# EAGLE design mega328 (EAGLE 9.5.0)
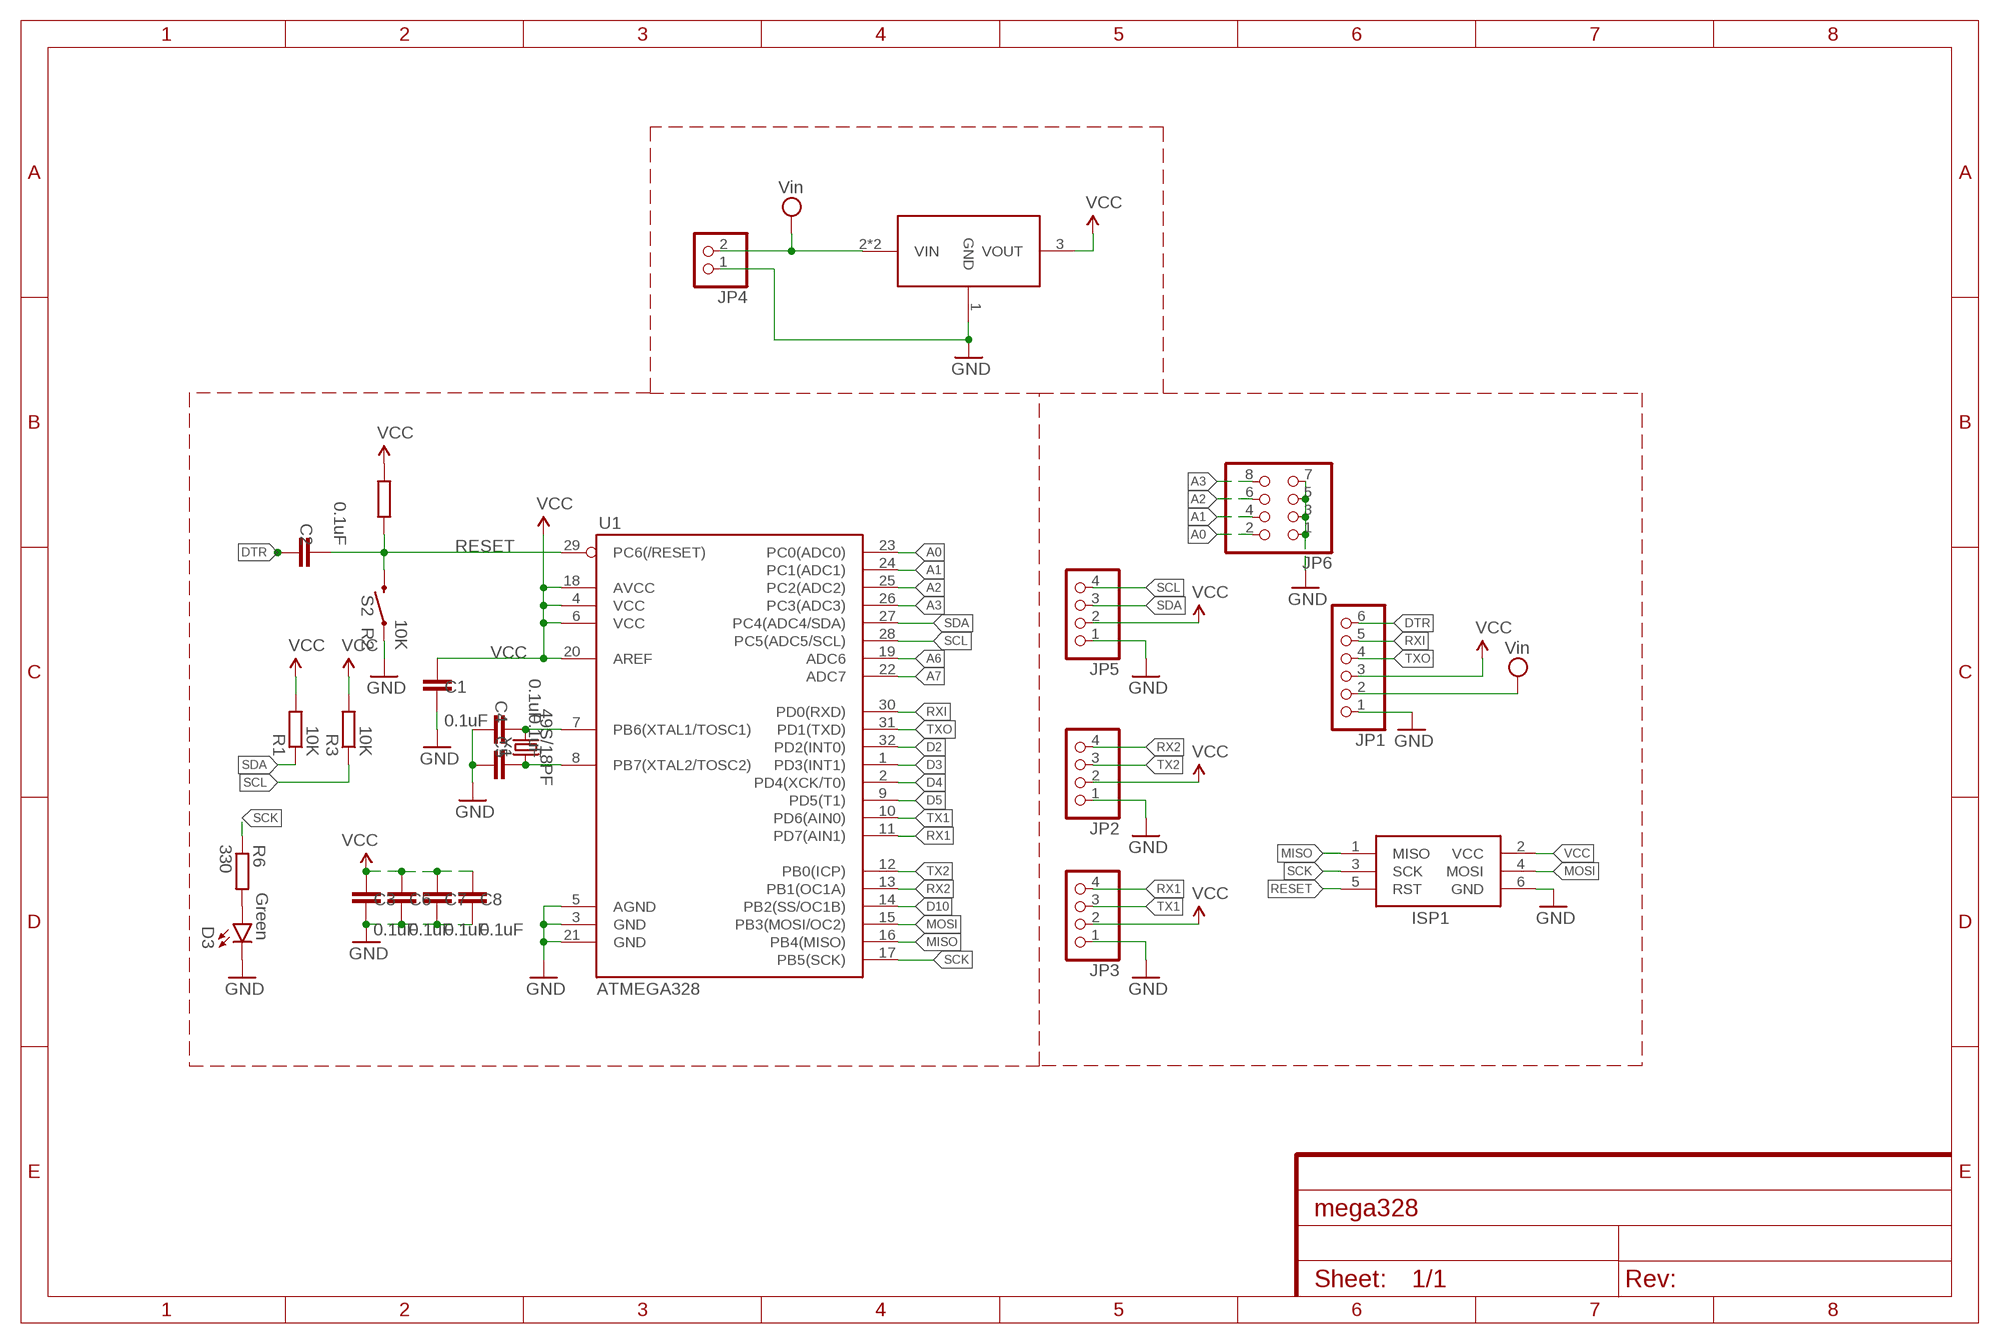
[diagram p0: schematic, sheet 1]

## Parts
C1  0.1uF  C-EUC0805  [C0805]
C2  0.1uF  C-EUC0805  [C0805]
C3  0.1uF  C-EUC0805  [C0805]
C4  0.1uF  C-EUC0805  [C0805]
C5  0.1uF  C-EUC0805  [C0805]
C6  0.1uF  C-EUC0805  [C0805]
C7  0.1uF  C-EUC0805  [C0805]
C8  0.1uF  C-EUC0805  [C0805]
D3  Green  LEDCHIP-LED0805  [CHIP-LED0805]
ISP1  AVRISP3D  [2X03]
JP1  PINHD-1X06_2.54-S  [1X06]
JP2  PINHD-1X04_2.54-S  [1X04-S]
JP3  PINHD-1X04_2.54-S  [1X04-S]
JP4  PINHD-1X02_2.54-S  [1X02-S]
JP5  PINHD-1X04_2.54-S  [1X04-S]
JP6  PINHD-2X4  [2X04]
R1  10K  R-EU_R0805  [R0805]
R2  10K  R-EU_R0805  [R0805]
R3  10K  R-EU_R0805  [R0805]
R6  330  R-EU_R0805  [R0805]
S2  MOMENTARY-SWITCH-SPST-PTH-6.0MM  [TACTILE_SWITCH_PTH_6.0MM]
U1  ATMEGA328  ATMEGA168  [TQFP32-08]
U$1  AIC1722A-33PXATR  [SOT89]
Y1  49S/18PF  [XTAL_HC49]

## Nets
A0: JP6.2 U1.23(PC0(ADC0))
A1: JP6.4 U1.24(PC1(ADC1))
A2: JP6.6 U1.25(PC2(ADC2))
A3: JP6.8 U1.26(PC3(ADC3))
A6: U1.19(ADC6)
A7: U1.22(ADC7)
D2: U1.32(PD2(INT0))
D3: U1.1(PD3(INT1))
D4: U1.2(PD4(XCK/T0))
D5: U1.9(PD5(T1))
D10: U1.14(PB2(SS/OC1B))
DTR: C2.2 JP1.6
GND: C1.1 C3.1 C4.2 C5.2 C6.1 C7.1 C8.1 D3.C ISP1.6(GND) JP1.1 JP2.1 JP3.1 JP4.1 JP5.1 JP6.1 JP6.3 JP6.5 JP6.7 S2.1 S2.2 U1.3(GND) U1.5(AGND) U1.21(GND) U$1.1(GND)
MISO: ISP1.1(MISO) U1.16(PB4(MISO))
MOSI: ISP1.4(MOSI) U1.15(PB3(MOSI/OC2))
N$1: C5.1 U1.8(PB7(XTAL2/TOSC2)) Y1.1
N$2: C4.1 U1.7(PB6(XTAL1/TOSC1)) Y1.2
N$7: D3.A R6.2
RESET: C2.1 ISP1.5(RST) R2.1 S2.3 S2.4 U1.29(PC6(/RESET))
RX1: JP3.4 U1.11(PD7(AIN1))
RX2: JP2.4 U1.13(PB1(OC1A))
RXI: JP1.5 U1.30(PD0(RXD))
SCK: ISP1.3(SCK) R6.1 U1.17(PB5(SCK))
SCL: JP5.4 R3.1 U1.28(PC5(ADC5/SCL))
SDA: JP5.3 R1.1 U1.27(PC4(ADC4/SDA))
TX1: JP3.3 U1.10(PD6(AIN0))
TX2: JP2.3 U1.12(PB0(ICP))
TXO: JP1.4 U1.31(PD1(TXD))
VCC: C1.2 C3.2 C6.2 C7.2 C8.2 ISP1.2(VCC) JP1.3 JP2.2 JP3.2 JP5.2 R1.2 R2.2 R3.2 U1.4(VCC) U1.6(VCC) U1.18(AVCC) U1.20(AREF) U$1.3(VOUT)
VIN: JP1.2 JP4.2 U$1.2(VIN) U$1.2@1(VIN) ; supply symbol labelled Vin

## Library data of the parts
C1-C8 = rcl:C-EU: CAPACITOR, European symbol; SPICEPREFIX: C
D3 = led:LED: LED OSRAM: - CHIPLED LG R971, LG N971, LY N971, LG Q971, LY Q971, LO R971, LY R971 LH N974, LH R974 LS Q976, LO Q976, LY Q976 LO Q996 - Hyper CHIPLED LW Q18S LB Q993, LB Q99A, LB R99A - SideLED LS A670, LO A670, LY A670, LG A670, LP A670 LB A673, LV A673, LT A673, LW A673 LH A674 LY A675 LS A676, LA A676, LO A676, LY A676, LW A676 LS A679, LY A679, LG A679 - Hyper Micro SIDELED® LS Y876, LA Y876, LO Y876, LY Y876 LT Y87S - SmartLED LW L88C, LW L88S LB L89C, LB L89S, LG L890 LS L89K, LO L89K, LY L89K LS L896, LA L896, LO L896, LY L896 - TOPLED LS T670, LO T670, LY T670, LG T670, LP T670 LSG T670, LSP T670, LSY T670, LOP T670, LYG T670 LG T671, LOG T671, LSG T671 LB T673, LV T673, LT T673, LW T673 LH T674 LS T676, LA T676, LO T676, LY T676, LB T676, LH T676, LSB T676, LW T676 LB T67C, LV T67C, LT T67C, LS T67K, LO T67K, LY T67K, LW E67C LS E67B, LA E67B, LO E67B, LY E67B, LB E67C, LV E67C, LT E67C LW T67C LS T679, LY T679, LG T679 LS T770, LO T770, LY T770, LG T770, LP T770 LB T773, LV T773, LT T773, LW T773 LH T774 LS E675, LA E675, LY E675, LS T675 LS T776, LA T776, LO T776, LY T776, LB T776 LHGB T686 LT T68C, LB T68C - Hyper Mini TOPLED® LB M676 - Mini TOPLED Santana® LG M470 LS M47K, LO M47K, LY M47K Source: http://www.osram.convergy.de LUXEON: - LUMILED® LXK2-PW12-R00, LXK2-PW12-S00, LXK2-PW14-U00, LXK2-PW14-V00 LXK2-PM12-R00, LXK2-PM12-S00, LXK2-PM14-U00 LXK2-PE12-Q00, LXK2-PE12-R00, LXK2-PE12-S00, LXK2-PE14-T00, LXK2-PE14-U00 LXK2-PB12-K00, LXK2-PB12-L00, LXK2-PB12-M00, LXK2-PB14-N00, LXK2-PB14-P00, LXK2-PB14-Q00 LXK2-PR12-L00, LXK2-PR12-M00, LXK2-PR14-Q00, LXK2-PR14-R00 LXK2-PD12-Q00, LXK2-PD12-R00, LXK2-PD12-S00 LXK2-PH12-R00, LXK2-PH12-S00 LXK2-PL12-P00, LXK2-PL12-Q00, LXK2-PL12-R00 Source: www.luxeon.com KINGBRIGHT: KA-3528ASYC Source: www.kingbright.com
ISP1 = adafruit-edit:AVRISP: AVR ISP HEADER Standard 6 pin header for AVR programming
JP1 = pinhead-2:PINHD-1X06: PIN HEADER
JP2 JP3 JP5 = pinhead-2:PINHD-1X04: PIN HEADER
JP4 = pinhead-2:PINHD-1X02: PIN HEADER
JP6 = pinhead:PINHD-2X4: PIN HEADER
R1-R3 R6 = rcl:R-EU_: RESISTOR, European symbol; SPICEPREFIX: R
S2 = SparkFun-Switches-edit:MOMENTARY-SWITCH-SPST: Momentary Switch (Pushbutton) - SPST Normally-open (NO) SPST momentary switches (buttons, pushbuttons). Variants PTH-12MM - 12mm square, through-hole Momentary Pushbutton Switch - 12mm Square <https://www.sparkfun.com/products/9190> (COM-09190) PTH-6.0MM, PTH-6.0MM-KIT - 6.0mm square, through-hole Mini Pushbutton Switch <https://www.sparkfun.com/products/97> (COM-00097) KIT package intended for soldering kit's - only one side of pads' copper is exposed. PTH-RIGHT-ANGLE-KIT - Right-angle, through-hole Right Angle Tactile Button <https://www.sparkfun.com/products/10791> - Used on SparkFun BigTime Watch Kit <https://www.sparkfun.com/products/11734> SMD-12MM - 12mm square, surface-mount Tactile Button - SMD (12mm) <https://www.sparkfun.com/products/12993> (COM-12993) Used on SparkFun PicoBoard <https://www.sparkfun.com/products/11888> SMD-4.5MM - 4.5mm Square Trackball Switch Used on SparkFun Blackberry Trackballer Breakout <https://www.sparkfun.com/products/13169> SMD-4.6MMX2.8MM - 4.60mm x 2.80mm, surface mount Used on SparkFun SAMD21 Mini Breakout <https://www.sparkfun.com/products/13664> SMD-5.2MM, SMD-5.2-REDUNDANT - 5.2mm square, surface-mount Mini Pushbutton Switch - SMD <https://www.sparkfun.com/products/8720> (COM-08720) Used on Arduino Pro Mini <https://www.sparkfun.com/products/11114> REDUNDANT package connects both switch circuits together SMD-6.0X3.5MM - 6.0 x 3.5mm, surface mount Momentary Reset Switch SMD <https://www.sparkfun.com/products/8229> (COM-08229) SMD-6.2MM-TALL - 6.2mm square, surface mount Tactile Button - SMD (6mm) <https://www.sparkfun.com/products/12992> Used on SparkFun Digital Sandbox <https://www.sparkfun.com/products/12651> SMD-RIGHT-ANGLE - Right-angle, surface mount Used on SparkFun Block for Intel® Edison - Arduino <https://www.sparkfun.com/products/13036>; PROD_ID: SWCH-08441; SF_SKU: COM-00097
U1 = mega328:ATMEGA168
U$1 = AIC1722-33PXATR:AIC1722A-33PXATR
Y1 = Crystals:49S/18PF: Crystal Manufacturer's datasheet <https://datasheet.octopart.com/49S-18PF-Xinhunjing-datasheet-30677139.pdf>; CREATED_BY: PCBLayout.com; MANUFACTURER: Xinhunjing; MPN: 49S/18PF; PACKAGE: SMD

## Net classes
0 default: width 0.203 mm
1 vcc: width 0.254 mm

## Board
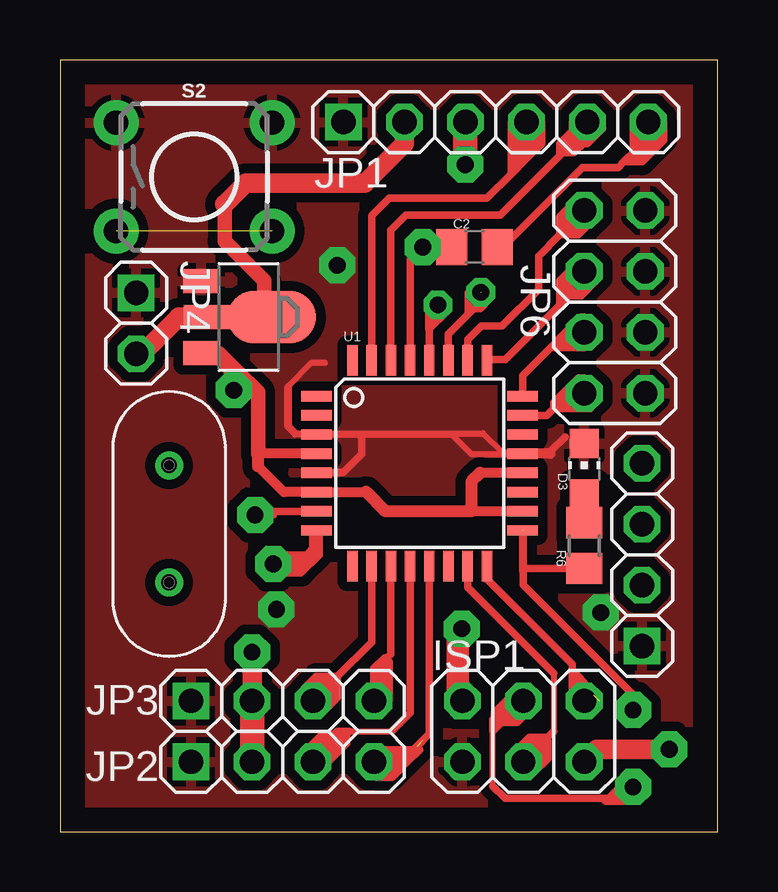
[diagram p1: board, top side]
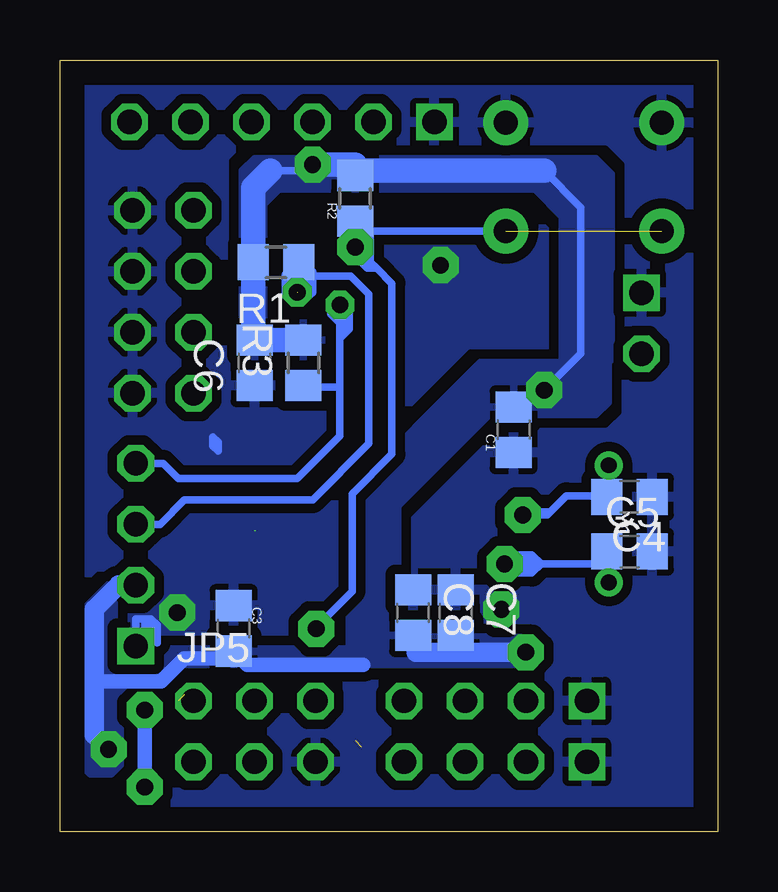
[diagram p2: board, bottom side, seen from below]

Size 27.41 x 32.18 mm. Coordinates in mm from the lower left corner, seen from the top.
Outline: 0,0 27.41,0 27.41,32.18 0,32.18 0,0
Copper layers (1*16): Top 0.035mm / dielectric 1.5mm / Bottom 0.035mm
Design rules "local_pcb": minimum track width 10mil, minimum drill 0.7mm, track to track 16mil, track to pad 16mil, pad to pad 16mil, via to via 16mil, smd to smd 2mil, copper to edge 40mil, drill to drill 6mil, minimum pad ring 10mil, minimum via ring 8mil, stop-mask expansion 4mil, vias tented up to drill 0mil, thermal gap 10mil

### Footprints (pad centres in the part's own frame; a part is rotated, then mirrored left to right if it is on the bottom)
C0805 = smd 1.3 x 1.5: 1 -0.95,0; 2 0.95,0
CHIP-LED0805 = smd 1.2 x 1.2: A 0,-1.05; C 0,1.05
2X03 = drill 1.016 octagon: 1 -2.54,-1.27; 2 -2.54,1.27; 3 0,-1.27; 4 0,1.27; 5 2.54,-1.27; 6 2.54,1.27
1X06 = drill 1.016 square: 1 -6.35,0 | drill 1.016 octagon: 2 -3.81,0; 3 -1.27,0; 4 1.27,0; 5 3.81,0; 6 6.35,0
1X04-S = drill 1.016 square: 1 -3.81,0 | drill 1.016 octagon: 2 -1.27,0; 3 1.27,0; 4 3.81,0
1X02-S = drill 1.016 square: 1 -1.27,0 | drill 1.016 octagon: 2 1.27,0
2X04 = drill 1.016 octagon: 1 -3.81,-1.27; 2 -3.81,1.27; 3 -1.27,-1.27; 4 -1.27,1.27; 5 1.27,-1.27; 6 1.27,1.27; 7 3.81,-1.27; 8 3.81,1.27
R0805 = smd 1.3 x 1.5: 1 -0.95,0; 2 0.95,0
TACTILE_SWITCH_PTH_6.0MM = drill 1.016 pad 1.88: 1 -3.251,2.261; 2 3.251,2.261; 3 -3.251,-2.261; 4 3.251,-2.261
TQFP32-08 = smd 1.27 x 0.432: 1 -4.293,2.8; 2 -4.293,2; 3 -4.293,1.2; 4 -4.293,0.4; 5 -4.293,-0.4; 6 -4.293,-1.2; 7 -4.293,-2; 8 -4.293,-2.8; 17 4.293,-2.8; 18 4.293,-2; 19 4.293,-1.2; 20 4.293,-0.4; 21 4.293,0.4; 22 4.293,1.2; 23 4.293,2; 24 4.293,2.8 | smd 0.432 x 1.27: 9 -2.8,-4.293; 10 -2,-4.293; 11 -1.2,-4.293; 12 -0.4,-4.293; 13 0.4,-4.293; 14 1.2,-4.293; 15 2,-4.293; 16 2.8,-4.293; 25 2.8,4.293; 26 2,4.293; 27 1.2,4.293; 28 0.4,4.293; 29 -0.4,4.293; 30 -1.2,4.293; 31 -2,4.293; 32 -2.8,4.293
SOT89 = smd 1 x 1.5: 1 -1.499,-1.981; 3 1.499,-1.981 | smd 1 x 2: 2 0,-1.727 | smd 2.2 x 3.7: 2@1 0,0.94
XTAL_HC49 = drill 0.65 pad 1.05: 1 -2.44,0; 2 2.44,0

### Placement (x,y rotation side)
C1  8.51,16.76 90 bottom
C2  17.27,24.38 0 top
C3  20.18,8.48 270 bottom
C4  3.68,13.97 0 bottom
C5  3.68,11.68 0 bottom
C6  19.3,19.56 90 bottom
C7  10.92,9.14 270 bottom
C8  12.7,9.14 270 bottom
D3  21.84,15.14 0 top
ISP1  19.3,4.19 180 top
JP1  18.16,29.59 0 top
JP2  9.27,2.92 0 top
JP3  9.27,5.46 0 top
JP4  3.17,21.21 270 top
JP5  24.26,11.56 90 top
JP6  23.11,22.1 90 top
R1  18.41,23.75 180 bottom
R2  15.11,26.42 90 bottom
R3  17.27,19.56 90 bottom
R6  21.84,11.94 90 top
S2  5.59,27.3 0 top
U1  14.99,15.37 0 top
U$1  7.87,21.46 270 top
Y1  4.55,12.84 90 top

### Tracks (layer width: path | path; a pad name or v marks a point on that pad's centre or on a via)
A0
  Top 0.305: U1.23 20.29,17.37 20.57,17.65 | 20.57,17.65 21.21,18.29 JP6.2 21.84,18.92 21.59,18.92 20.57,17.91 20.57,17.65 | 20.57,17.65 22.1,17.65 21.97,17.78 21.97,17.91 21.08,17.91 20.95,17.78
A1
  Top 0.305: U1.24 19.28,19.02 20.45,20.19 | 20.45,20.19 21.08,20.83 | 21.08,20.83 JP6.4 21.84,21.46 21.72,21.46 21.08,20.83 | 20.45,20.19 21.84,20.19 21.84,20.45 20.83,20.45 21.46,21.08 21.72,21.08
A2
  Top 0.305: U1.25 17.79,19.68 18.54,19.68 19.18,20.32 20.83,21.97 | JP6.6 21.84,22.99 21.21,22.35 | 21.21,22.35 20.83,21.97 | JP6.6 21.21,23.37 21.21,22.35 | 21.21,22.35 21.72,22.35 22.35,22.99 21.97,23.37 JP6.6 | JP6.6 21.72,23.24 21.34,23.24 21.34,22.73 | 21.34,22.73 21.34,22.61 21.46,22.48 22.1,23.11 21.72,23.11 21.34,22.73 | 20.83,21.97 20.83,22.99 20.95,23.11 | 21.46,23.62 20.95,23.11 | 20.95,23.11 20.95,22.35
A3
  Top 0.305: U1.26 16.99,20.52 17.55,21.08 18.41,21.08 19.94,22.61 19.94,24 20.83,24.89 | 20.83,24.89 JP6.8 21.46,26.29 20.83,25.65 20.83,24.89 | 20.83,24.89 21.59,24.89 22.23,25.53 21.97,25.78 21.21,25.02 21.59,25.02 22.1,25.53 21.72,25.91 21.46,25.91 20.95,25.4 20.95,25.27
DTR
  Top 0.305: 23.5,27.94 23.25,27.7 21.77,27.7 18.45,24.38 C2.2 | 23.5,27.94 23.62,28.07 | 23.88,28.32 24.51,28.96 JP1.6 25.15,29.59 25.15,29.21 | 25.15,29.21 24,28.07 23.62,28.07 | 23.62,28.07 23.88,28.32 | 23.88,28.32 23.88,29.59 24.26,29.59 24.26,29.08 24,28.83 | 25.15,29.21 25.15,28.83 24.26,27.94 23.5,27.94
GND  (via drill 0.7 pad 1.5)
  Top 0.254: 19.68,15.77 19.67,15.75 17.18,15.75 17.17,15.75 17.14,15.75 16.33,16.57 12.45,16.57 U1.3 9.8,16.57 9.47,16.89 9.47,18.55 9.53,18.6 | 20.14,15.82 18.42,15.82 17.62,16.62 9.84,16.62 9.53,16.93 9.53,18.6 | 11.05,19.56 10.48,19.56 9.53,18.6
  Top 0.305: U1.5 10.71,14.99 11.81,14.99 12.57,15.75 12.57,16.44 12.45,16.57 | 21.04,16.47 20.45,15.88 20.45,15.77
  Top 0.406: U1.21 19.68,15.77 20.45,15.77
  Bottom 0.305: 23.37,7.87 23.37,8.64 23.62,8.89 24.26,8.89 JP5.1 23.88,8.13 23.88,8.76 23.62,8.51 23.62,7.87 | 21.04,16.47 20.83,16.26 20.83,15.88 21.04,16.09 21.04,16.47
  other vias: 11.56,23.62 9.02,9.27 22.53,9.14
  pour Top (isolate 0.305, rank 2): 0,32.18 0,0 27.29,0 27.29,32.18
  pour Bottom (isolate 0.305, rank 2): 0,32.18 0,0 27.29,0 27.29,32.18
MISO  (1 unrouted)
  Top 0.305: 21.59,6.48 21.84,6.22 ISP1.1 22.48,5.46 | 21.59,6.48 21.34,6.73 | U1.16 17.78,10.54 21.34,6.99 21.34,6.73 | 21.34,6.73 21.34,5.46 21.59,5.46 21.59,6.48 | 22.23,5.71 21.97,5.97
MOSI
  Top 0.254: 20.57,6.6 20.57,4.19
  Top 0.305: U1.15 16.99,10.19 20.57,6.6 | 20.57,4.19 20.32,3.94 | 20.32,3.94 ISP1.4 18.92,3.3 19.56,3.94 20.32,3.94 | 20.32,3.94 20.32,3.05 19.68,2.41 19.56,2.54 19.56,2.79 20.19,3.43 20.19,3.17 19.68,2.67 19.3,3.05 19.3,3.3 19.81,3.81
N$1  (via drill 0.7 pad 1.5)
  Top 0.305: U1.8 10.69,11.46 10.41,11.18 v8.89,11.18 | v8.89,11.18 8.89,11.3 | 8.89,11.3 8.89,11.56 10.29,11.56 10.54,11.81 | 10.54,11.81 10.54,12.57 | 10.54,11.81 10.54,11.68 10.16,11.3 8.89,11.3 | 8.89,11.05 8.89,10.79 10.03,10.79 10.79,11.56 10.79,12.57 | v8.89,11.18 8.89,11.05 | 8.89,11.05 10.03,11.05
  Bottom 0.305: 7.37,11.18 v8.89,11.18 8.89,11.56 7.75,11.56 7.37,11.18 | C5.1 4.55,11.6 4.55,11.3 | 4.55,11.3 Y1.1 | 7.37,11.18 7.75,10.79 8.89,10.79 8.89,10.92 7.87,10.92 7.87,11.43 8.76,11.43 | 4.55,11.3 4.67,11.18 7.37,11.18
N$2  (via drill 0.7 pad 1.5)
  Top 0.305: U1.7 8.29,13.37 v8.13,13.21 8.89,13.21
  Bottom 0.305: 6.99,13.34 7.11,13.21 v8.13,13.21 8.13,13.34 6.99,13.34 | 6.99,13.34 6.31,14.01 4.67,14.01 4.55,14.01 Y1.2
  Bottom 1.016: 4.67,14.01 C4.1
N$7
  Top 0.305: R6.2 D3.A
RESET  (via drill 0.7 pad 1.5)  (1 unrouted)
  Top 0.305: U1.29 14.59,23.86 v15.11,24.38 | 16.51,8.48 16.51,8.64 16.26,8.64 16.26,6.86 16.51,6.6 16.51,5.46 | 16.51,8.47 16.51,6.99 16.76,6.73 ISP1.5 16.26,5.46 16.26,6.99 | 16.89,6.73 16.89,8.47 v16.74,8.47 16.51,8.47 | 16.89,5.46 16.89,6.73 | 16.89,6.73 16.64,6.99 16.64,8.51 | 16.51,8.48 16.26,8.48 16.26,7.11 | 16.51,8.48 16.51,8.47
  Top 0.508: C2.1 v15.11,24.38
  Bottom 0.305: S2.4 14.69,25.04 R2.1 v15.11,24.38 | 14.22,23.5 13.59,22.86 13.59,15.75 15.24,14.1 15.24,10.03 16.74,8.53 v16.74,8.47 | 14.61,23.88 v15.11,24.38 | v15.11,24.38 14.61,24.38 | 14.61,24.38 14.61,25.15 | 14.61,24.38 14.61,23.88 | 14.61,23.88 14.48,23.75 | 14.48,23.75 14.22,23.5 | 14.22,23.5 14.61,23.5 15.11,24 | v15.11,24.38 14.48,24.38 | 14.48,24.38 14.48,25.02 | 14.48,24.38 14.48,23.75
RX1
  Top 0.305: U1.11 13.79,7.39 13.53,7.14 13.53,5.91 JP3.4 13.08,6.81 13.54,7.26 13.72,7.09 13.72,5.46 13.21,5.46 13.34,5.59 13.34,5.97 | 13.34,6.86 13.34,5.97 | 13.34,5.97 13.59,5.71
RX2  (1 unrouted)
  Top 0.305: JP2.4 14.48,2.92 | U1.13 15.39,4.08 14.86,3.56 | 14.48,2.92 14.99,3.43 13.08,3.43 JP2.4 | 14.48,2.92 13.84,2.29 13.21,2.29 13.08,2.41 13.08,2.67 | 13.08,2.67 13.08,2.79 | 13.08,2.79 13.21,2.79 13.21,3.17 14.48,3.17 | JP2.4 14.22,2.92 15.11,3.81 | JP2.4 13.08,2.79 | 13.08,2.67 14.1,2.67 13.97,2.54 13.21,2.54
RXI
  Top 0.305: U1.30 13.79,25.09 14.4,25.7 18.34,25.7 20.83,28.19 | 20.83,28.19 21.34,28.7 | 21.34,28.7 21.97,29.34 JP1.5 21.34,29.59 21.34,29.21 | 21.34,29.21 21.34,28.7 | 21.34,28.7 21.72,28.7 | 21.46,29.34 21.59,29.46 21.72,29.46 21.72,28.83 22.23,29.34 22.61,29.34 21.97,28.7 21.79,28.7 | 21.34,29.21 20.83,28.7 20.83,28.32 | 20.83,28.32 20.83,28.19 | 20.83,28.32 21.41,28.32 21.79,28.7 | 21.79,28.7 21.72,28.7 | 21.72,28.7 21.34,28.32 21.21,28.32 20.95,28.57 21.08,28.7 21.21,28.7
SCK  (via drill 0.7 pad 1.5)  (1 unrouted)
  Top 0.254: 18.03,1.91 18.03,4.19
  Top 0.305: 18.03,1.91 18.54,1.4 22.61,1.4 | 18.41,4.57 18.03,4.19 18.03,4.7 18.09,4.75 | 18.41,4.57 ISP1.3 | ISP1.3 19.3,4.83 19.05,4.57 18.41,4.57 | ISP1.3 18.95,5.82 18.09,4.95 18.09,4.75 | 18.09,4.75 18.92,5.59 18.92,5.33 18.29,4.7 18.8,4.7 19.18,5.08 | 19.28,10.86 U1.17 | v23.88,1.87 23.88,1.4 22.86,1.4 | 22.61,1.4 22.86,1.4 | 22.86,1.4 23.37,1.91 24.13,1.91 24.13,1.78 24,1.65 23.37,1.65 | 23.24,1.65 23.37,1.65 | 23.37,1.65 23.5,1.78 23.88,1.78 | 19.3,12.57 19.3,11.05 | 19.3,11.05 19.3,10.29 23.88,5.71 v23.88,5.08 | 22.61,1.4 22.73,1.27 23.5,1.27 23.62,1.4 23.62,1.52 | R6.1 19.36,10.99 19.3,11.05
  Bottom 0.61: v23.88,5.08 v23.88,1.87
SCL  (via drill 0.7 pad 1.2)
  Top 0.305: U1.28 15.39,21.61 v15.75,21.97 15.49,22.23 15.37,22.1 15.37,20.95 16.13,21.72 16.13,21.84 16,21.84 15.49,21.34
  Bottom 0.305: 15.75,21.21 v15.75,21.97 16.13,21.97 16.13,21.59 15.75,21.21 | 15.75,20.57 15.75,18.54 | 15.75,18.54 15.75,16.51 17.53,14.73 22.48,14.73 23.11,15.37 JP5.4 | R3.1 17.21,18.54 15.75,18.54 | 15.75,21.21 15.75,20.57 | 15.75,20.57 15.37,20.95 15.37,21.97 15.49,21.97 15.49,20.95
SDA  (via drill 0.7 pad 1.2)  (1 unrouted)
  Top 0.305: U1.27 16.19,20.76 17.02,21.59 | v17.53,22.5 17.53,22.48 | 17.53,22.48 17.53,22.1 17.25,21.82 | 17.25,21.82 17.02,21.59 | 17.53,22.48 17.02,22.48 17.02,21.59 | 17.25,21.82 17.5,21.82 17.91,22.23 17.4,22.23
  Bottom 0.305: 17.59,24.19 R1.1 17.43,23.72 17.5,23.65 | 17.5,23.65 17.02,23.18 15.3,23.18 14.54,22.42 14.54,16.19 16.89,13.84 22.23,13.84 23.24,12.83 JP5.3 | v17.53,22.5 17.53,23.62 17.5,23.65 | 17.53,22.48 18.03,22.48 18.03,23.24 17.91,23.37 16.89,23.37 16.89,22.48 17.02,22.35 17.02,22.99 17.53,22.99 17.78,22.73
TX1
  Top 0.305: JP3.3 11.56,6.48 | 11.56,6.48 12.99,7.91 U1.10 | JP3.3 10.16,5.84 10.16,5.97 10.67,6.48 11.56,6.48 | 11.56,6.48 11.56,5.59 11.05,5.08 10.92,5.08 JP3.3 | JP3.3 10.67,5.46 10.41,5.71 10.41,5.84 10.92,6.35 11.18,6.35 10.54,5.71 | JP3.3 10.79,5.46 11.43,6.1 11.43,5.71 10.92,5.21
TX2
  Top 0.254: 12.05,4.19 13.82,4.19
  Top 0.305: 11.68,4.06 11.81,4.19 | 13.82,4.19 14.59,4.95 U1.12 | JP2.3 10.29,3.17 | 10.29,3.17 10.16,3.3 10.92,4.06 11.68,4.06 | 11.94,3.94 11.94,3.68 10.92,2.67 10.79,2.79 10.99,2.98 10.67,3.3 10.99,3.62 | 10.99,3.62 11.11,3.75 | 11.11,3.75 11.3,3.94 | 11.3,3.94 11.3,4.06 11.56,4.06 11.68,3.94 11.05,3.3 | 10.29,3.17 10.92,3.81 11.05,3.81 | 11.81,4.19 11.94,4.19 11.94,3.94 | 11.24,3.62 JP2.3 | JP2.3 10.92,2.92 11.94,3.94 | 11.3,3.94 11.56,4.19 11.81,4.19 | 11.68,4.06 11.24,3.62 | 11.24,3.62 10.99,3.62 | 11.11,3.75 11.6,3.75 12.05,4.19
TXO
  Top 0.305: U1.31 12.99,25.69 13.72,26.42 17.78,26.42 18.8,27.43 | 19.43,28.07 JP1.4 | 18.8,27.43 19.43,28.07 | JP1.4 18.8,29.59 18.8,27.43 | 19.43,28.07 20.07,28.7 20.07,29.59 JP1.4 | JP1.4 19.18,29.34 19.05,29.34 19.05,27.94 19.18,28.07 19.18,29.21 19.43,29.46 19.68,29.46 19.68,28.7 | 19.68,28.7 19.56,28.57 | 19.68,28.7 19.94,28.96 19.94,29.34
VCC  (via drill 0.7 pad 1.5)
  Top 0.406: U1.4 8.26,15.77 | 8.26,15.24 9.33,14.17 U1.6 12.74,14.17 12.75,14.17 | U1.18 17.14,13.37 | U1.20 17.51,14.97
  Top 0.508: 6.1,20.17 U$1.3 | 8.26,15.24 8.26,15.77 | 12.75,14.17 13.56,13.37 17.14,13.37 17.14,14.61 17.51,14.97 | 7.11,19.2 6.48,19.84 | 8.26,18.33 8.17,18.41 v7.24,18.41 7.11,18.54
  Top 0.61: 7.38,19.2 8.26,18.33 8.26,15.77 | 7.38,19.2 7.11,19.2 7.11,18.54 | 6.48,19.84 5.89,19.84 U$1.3 6.62,19.96 7.38,19.2 | v7.24,18.41 7.24,19.06 7.38,19.2
  Top 0.813: v8,7.49 JP3.2 | ISP1.2 22.36,3.44 v25.39,3.44
  Top 1.016: JP3.2 JP2.2 | JP1.3 v16.89,27.81
  Bottom 0.305: R2.2 15.11,27.56 15.11,27.81 | C7.2 10.92,7.62 10.79,7.49 | C8.2 12.7,7.62 12.57,7.49 | C6.2 19.3,26.92 18.65,27.57 17.13,27.57 v16.89,27.81 | v7.24,18.41 5.71,19.94 5.71,26.04 7.24,27.56
  Bottom 0.61: C6.2 19.5,20.7 | 14.77,6.97 19.62,6.97 C3.2 20.48,7.24 22.23,7.24 23.2,6.27 25.99,6.27
  Bottom 0.813: v8,7.49 10.79,7.49 12.57,7.49 | JP5.2 24.97,10.29 25.99,9.27 25.99,6.27 25.99,4.04 v25.39,3.44
  Bottom 1.016: 7.24,27.56 15.11,27.56 | v16.89,27.81 15.11,27.81 | 18.65,27.57 19.36,26.86 R1.2 19.36,20.57 C6.2 R3.2
  pour Bottom (isolate 0.406): 4.57,19.56 4.57,17.91 5.08,17.4 9.53,17.4 13.34,13.59 13.34,8.13 8.26,8.13 7.87,7.75 7.87,7.24 8.13,6.99 22.35,6.99 23.24,6.1 24.51,6.1 24.89,5.71 24.89,2.79 25.27,2.41 26.16,2.41 26.42,2.67 26.42,9.27 25.27,10.41 23.88,10.41 23.88,9.65 24,9.78 25.15,9.78 25.15,6.48 23.24,6.48 22.99,6.73 22.99,7.62 15.37,7.62 15.37,14.1 9.91,19.56
  pour Bottom: 4.45,19.68 6.48,19.68 6.48,25.65 7.62,26.8 18.29,26.8 18.92,26.16 18.92,21.21 16.76,21.21 16.51,20.95 16.51,20.07 16.76,19.81 19.68,19.81 19.81,19.94 19.81,27.56 19.3,28.07 5.08,28.07 4.45,27.43
VIN
  Top 0.508: U$1.2 5.88,21.2
  Top 0.61: 6.86,26.16 6.86,24.64 8.51,22.99 8.51,21.77 U$1.2@1
  Top 0.813: U$1.2 4.95,21.46 3.43,19.94 JP4.2 | JP1.2 14.35,28.7 12.7,27.05 7.75,27.05 6.86,26.16
  Top 1.016: U$1.2 U$1.2@1